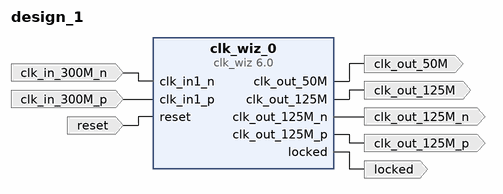
[diagram p0: block diagram of the top level]
# Vivado block design design_1, xczu9eg-ffvb1156-2-e, Vivado 2022.1
create_bd_design design_1

create_bd_port -dir I -type clk clk_in_300M_n
set_property -dict {CONFIG.FREQ_HZ 300000000} [get_bd_ports clk_in_300M_n]
create_bd_port -dir I -type clk clk_in_300M_p
set_property -dict {CONFIG.FREQ_HZ 300000000} [get_bd_ports clk_in_300M_p]
create_bd_port -dir I -type rst reset
set_property -dict {CONFIG.POLARITY ACTIVE_HIGH} [get_bd_ports reset]
create_bd_port -dir O locked
create_bd_port -dir O -type clk clk_out_125M_p
create_bd_port -dir O -type clk clk_out_125M_n
create_bd_port -dir O -type clk clk_out_125M
create_bd_port -dir O -type clk clk_out_50M

create_bd_cell -type ip -vlnv xilinx.com:ip:clk_wiz:6.0 clk_wiz_0
set_property -dict [list \
  CONFIG.CLKIN1_JITTER_PS 33.330000000000005 \
  CONFIG.CLKOUT1_JITTER 106.400 \
  CONFIG.CLKOUT1_PHASE_ERROR 84.520 \
  CONFIG.CLKOUT1_REQUESTED_OUT_FREQ 125 \
  CONFIG.CLKOUT2_JITTER 106.400 \
  CONFIG.CLKOUT2_PHASE_ERROR 84.520 \
  CONFIG.CLKOUT2_REQUESTED_OUT_FREQ 125 \
  CONFIG.CLKOUT2_REQUESTED_PHASE 180 \
  CONFIG.CLKOUT2_USED true \
  CONFIG.CLKOUT3_JITTER 106.400 \
  CONFIG.CLKOUT3_PHASE_ERROR 84.520 \
  CONFIG.CLKOUT3_REQUESTED_OUT_FREQ 125 \
  CONFIG.CLKOUT3_USED true \
  CONFIG.CLKOUT4_JITTER 126.438 \
  CONFIG.CLKOUT4_PHASE_ERROR 84.520 \
  CONFIG.CLKOUT4_REQUESTED_OUT_FREQ 50 \
  CONFIG.CLKOUT4_USED true \
  CONFIG.CLK_OUT1_PORT clk_out_125M_p \
  CONFIG.CLK_OUT2_PORT clk_out_125M_n \
  CONFIG.CLK_OUT3_PORT clk_out_125M \
  CONFIG.CLK_OUT4_PORT clk_out_50M \
  CONFIG.MMCM_CLKFBOUT_MULT_F 12.500 \
  CONFIG.MMCM_CLKIN1_PERIOD 3.333 \
  CONFIG.MMCM_CLKIN2_PERIOD 10.0 \
  CONFIG.MMCM_CLKOUT0_DIVIDE_F 10.000 \
  CONFIG.MMCM_CLKOUT1_DIVIDE 10 \
  CONFIG.MMCM_CLKOUT1_PHASE 180.000 \
  CONFIG.MMCM_CLKOUT2_DIVIDE 10 \
  CONFIG.MMCM_CLKOUT3_DIVIDE 25 \
  CONFIG.MMCM_DIVCLK_DIVIDE 3 \
  CONFIG.NUM_OUT_CLKS 4 \
  CONFIG.PRIM_IN_FREQ 300.000 \
  CONFIG.PRIM_SOURCE Differential_clock_capable_pin \
] [get_bd_cells clk_wiz_0]

# ---- connections ----

connect_bd_net [get_bd_ports clk_in_300M_n] [get_bd_pins clk_wiz_0/clk_in1_n]
connect_bd_net [get_bd_ports clk_in_300M_p] [get_bd_pins clk_wiz_0/clk_in1_p]
connect_bd_net [get_bd_pins clk_wiz_0/clk_out_125M] [get_bd_ports clk_out_125M]
connect_bd_net [get_bd_pins clk_wiz_0/clk_out_125M_n] [get_bd_ports clk_out_125M_n]
connect_bd_net [get_bd_pins clk_wiz_0/clk_out_125M_p] [get_bd_ports clk_out_125M_p]
connect_bd_net [get_bd_pins clk_wiz_0/clk_out_50M] [get_bd_ports clk_out_50M]
connect_bd_net [get_bd_pins clk_wiz_0/locked] [get_bd_ports locked]
connect_bd_net [get_bd_ports reset] [get_bd_pins clk_wiz_0/reset]

validate_bd_design
save_bd_design
